# EAGLE design chonkeegamp (EAGLE 9.6.2)
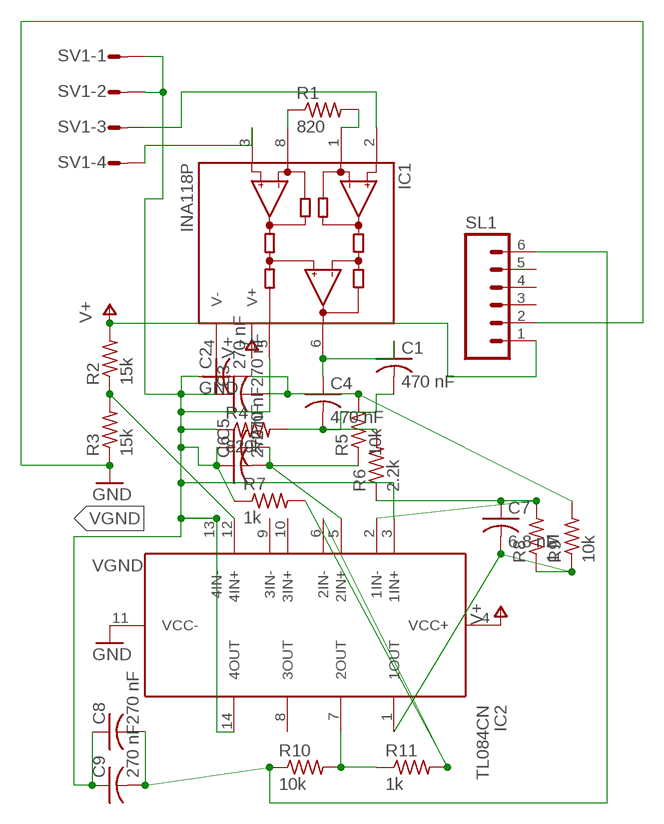
[diagram p0: schematic, sheet 1]

## Parts
C1  470 nF  C-US050-024X044  [C050-024X044]
C2  270 nF  C-US050-024X044  [C050-024X044]
C3  270 nF  C-US050-024X044  [C050-024X044]
C4  470 nF  C-US050-024X044  [C050-024X044]
C5  270 nF  C-US050-024X044  [C050-024X044]
C6  270 nF  C-US050-024X044  [C050-024X044]
C7  6.8 nF  C-US050-024X044  [C050-024X044]
C8  270 nF  C-US050-024X044  [C050-024X044]
C9  270 nF  C-US050-024X044  [C050-024X044]
IC1  INA118P  [DIL08]
IC2  TL084CN  [DIP794W53P254L1930H508Q14N]
R1  820  R-US_0207/7  [0207/7]
R2  15k  R-US_0207/7  [0207/7]
R3  15k  R-US_0207/7  [0207/7]
R4  820k  R-US_0207/7  [0207/7]
R5  10k  R-US_0207/7  [0207/7]
R6  2.2k  R-US_0207/7  [0207/7]
R7  1k  R-US_0207/7  [0207/7]
R8  1 M  R-US_0207/7  [0207/7]
R9  10k  R-US_0207/7  [0207/7]
R10  10k  R-US_0207/7  [0207/7]
R11  1k  R-US_0207/7  [0207/7]
SL1  M06  [06P]
SV1  L04P  [L04P]

## Nets
GND: IC1.4(V-) IC2.11(VCC-) R3.1 SL1.2
N$1: C1.1 C4.1 IC1.6(OUT)
N$2: C1.2 C4.2 R4.2 R6.2
N$3: C7.1 IC2.2(1IN-) R6.1 R8.2
N$4: C7.2 IC2.1(1OUT) R8.1 R9.1
N$5: C2.2 C3.2 R5.2 R9.2
N$6: C5.2 C6.2 IC2.5(2IN+) R5.1
N$7: IC1.3(+IN) SV1.4
N$8: IC2.6(2IN-) R7.2 R11.2
N$9: IC2.7(2OUT) R10.2 R11.1
N$10: C8.2 C9.2 R10.1 SL1.6
N$11: IC2.12(4IN+) R2.1 R3.2
N$12: IC1.2(-IN) SV1.3
N$15: IC1.1(RG) R1.2
N$16: IC1.8(RG) R1.1
V+: IC1.7(V+) IC2.4(VCC+) R2.2 SL1.1
VGND: C2.1 C3.1 C5.1 C6.1 C8.1 C9.1 IC1.5(REF) IC2.3(1IN+) IC2.13(4IN-) IC2.14(4OUT) R4.1 R7.1 SV1.1 SV1.2
Unconnected: IC2.8(3OUT) IC2.9(3IN-) IC2.10(3IN+) SL1.3 SL1.4 SL1.5

## Library data of the parts
C1 C4 = rcl:C-US: CAPACITOR, American symbol; MF: VISHAY; MPN: BFC237390043; OC_NEWARK: 04J0056; SPICEPREFIX: C
C2 C3 C5 C6 C8 C9 = rcl:C-US: CAPACITOR, American symbol; MF: VISHAY; MPN: BFC237390132; OC_NEWARK: 04J0079; SPICEPREFIX: C
C7 = rcl:C-US: CAPACITOR, American symbol; MF: KEMET; MPN: C315C682K1R5TA; OC_NEWARK: 18K5618; SPICEPREFIX: C
IC1 = burr-brown:INA118: Instrumentation Amplifier Precision, Low Power; MF: TEXAS INSTRUMENTS; MPN: INA118P; OC_FARNELL: 1470354; OC_NEWARK: 34AH0811
IC2 = SamacSys_Parts:TL084CN: Quad High Slew Rate JFET-Input Operational Amplifier Source: Datasheet <http://www.ti.com/lit/gpn/tl084>; DESCRIPTION: Quad High Slew Rate JFET-Input Operational Amplifier; HEIGHT: 5.08mm; MANUFACTURER_NAME: Texas Instruments; MANUFACTURER_PART_NUMBER: TL084CN; MF: TEXAS INSTRUMENTS; MOUSER_PART_NUMBER: 595-TL084CN; MOUSER_PRICE-STOCK: https://www.mouser.co.uk/ProductDetail/Texas-Instruments/TL084CN?qs=q2XTDbzbm6ANF36GVAxPiQ%3D%3D; MPN: TL084CN; OC_NEWARK: 33AH5107
R1 = rcl:R-US_: RESISTOR, American symbol; MF: MULTICOMP PRO; MPN: MCF 0.5W 820R; OC_NEWARK: 38K0319; SPICEPREFIX: R
R2 R3 = rcl:R-US_: RESISTOR, American symbol; MF: MULTICOMP PRO; MPN: MCF 1W 15K; OC_NEWARK: 38K0408; SPICEPREFIX: R
R4 = rcl:R-US_: RESISTOR, American symbol; MF: MULTICOMP PRO; MPN: MCF 0.25W 820K; OC_NEWARK: 38K0396; SPICEPREFIX: R
R5 R9 R10 = rcl:R-US_: RESISTOR, American symbol; MF: MULTICOMP PRO; MPN: MCCFR0W4J0103A50; OC_NEWARK: 58K5002; SPICEPREFIX: R
R6 = rcl:R-US_: RESISTOR, American symbol; MF: MULTICOMP PRO; MPN: MCF 0.5W 2K2; OC_NEWARK: 38K0282; SPICEPREFIX: R
R7 R11 = rcl:R-US_: RESISTOR, American symbol; MF: MULTICOMP PRO; MPN: MCCFR0S2J0102A20; OC_NEWARK: 58K4936; SPICEPREFIX: R
R8 = rcl:R-US_: RESISTOR, American symbol; MF: MULTICOMP PRO; MPN: MCF 0.5W 1M; OC_NEWARK: 38K0261; SPICEPREFIX: R
SL1 = con-amp-quick:M06: AMP QUICK CONNECTOR; OC_FARNELL: unknown; OC_NEWARK: unknown
SV1 = con-amp-mt:L04P: AMP MT CONNECTOR; OC_FARNELL: unknown; OC_NEWARK: unknown

## Board
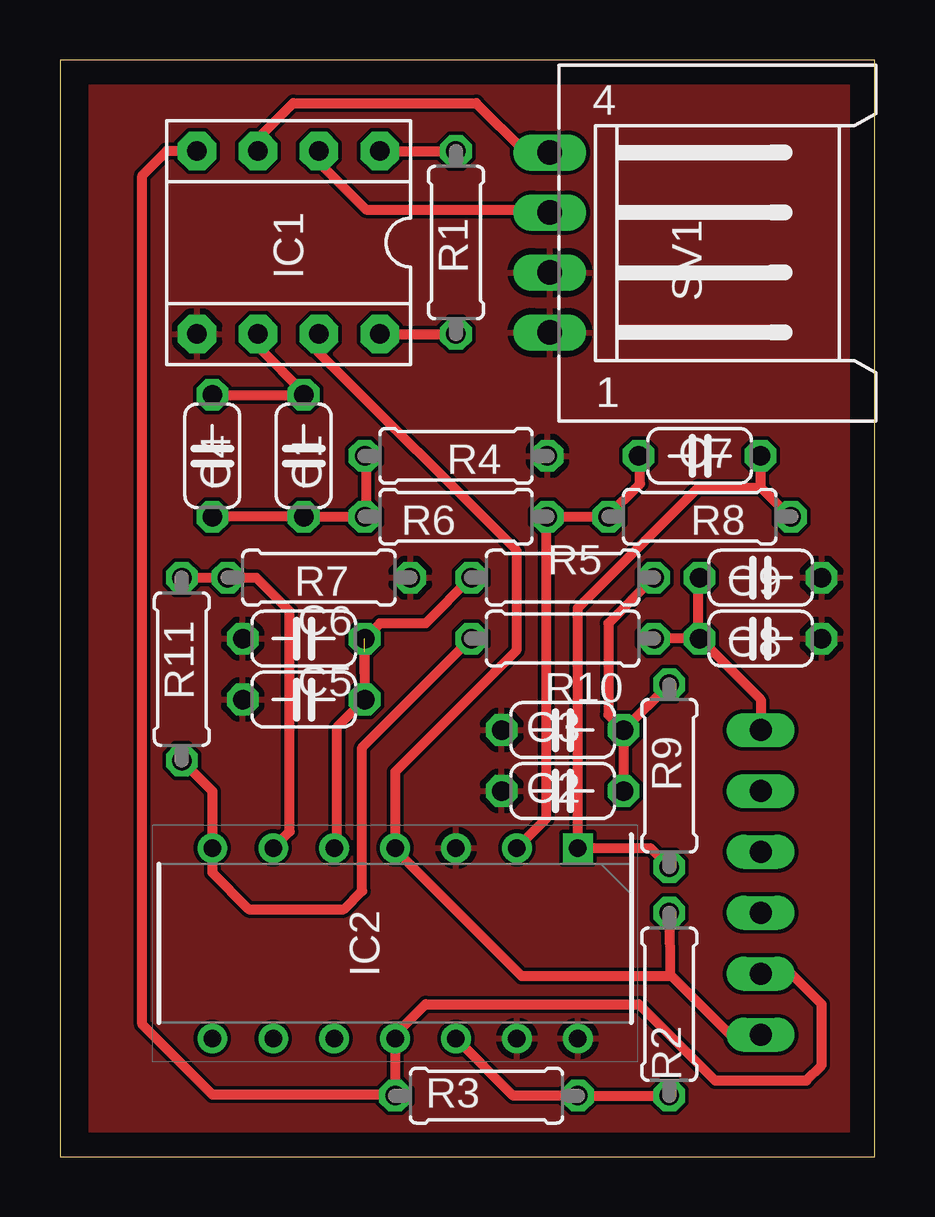
[diagram p1: board, top side]
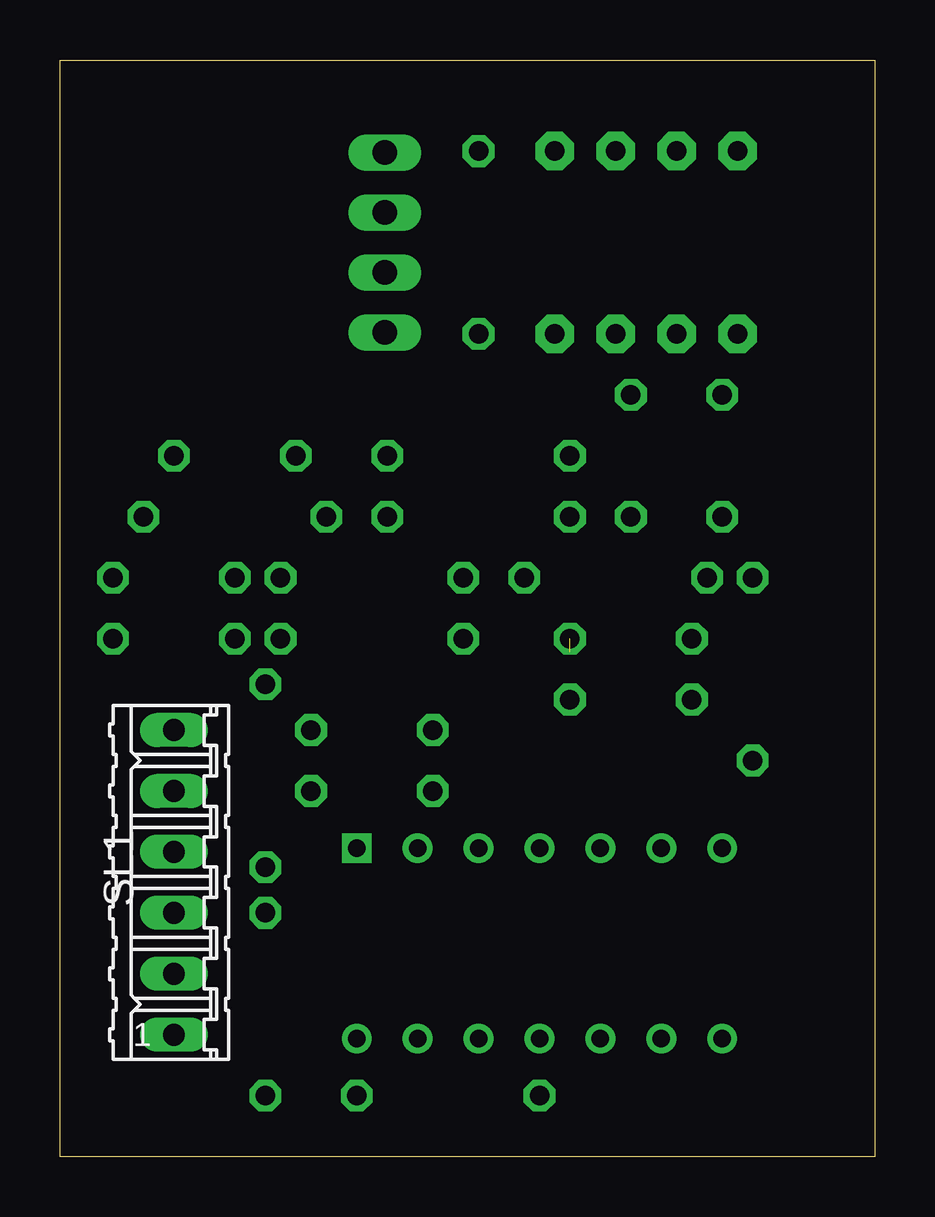
[diagram p2: board, bottom side, seen from below]

Size 33.96 x 45.71 mm. Coordinates in mm from the lower left corner, seen from the top.
Outline: 0,0 33.96,0 33.96,45.71 0,45.71 0,0
Copper layers (1*16): Top 0.035mm / dielectric 1.5mm / Bottom 0.035mm
Design rules "default": minimum track width 6mil, minimum drill 0.35mm, track to track 6mil, track to pad 6mil, pad to pad 6mil, via to via 6mil, smd to smd 6mil, copper to edge 40mil, drill to drill 6mil, minimum pad ring 10mil, minimum via ring 8mil, stop-mask expansion 4mil, vias tented up to drill 0mil, thermal gap 10mil

### Footprints (pad centres in the part's own frame; a part is rotated, then mirrored left to right if it is on the bottom)
C050-024X044 = drill 0.813 octagon: 1 -2.54,0; 2 2.54,0
DIL08 = drill 0.813 pad 1.6 octagon: 1 -3.81,-3.81; 2 -1.27,-3.81; 3 1.27,-3.81; 4 3.81,-3.81; 5 3.81,3.81; 6 1.27,3.81; 7 -1.27,3.81; 8 -3.81,3.81
DIP794W53P254L1930H508Q14N = drill 0.73 pad 1.13 square: 1 -3.97,7.62 | drill 0.73 pad 1.13: 2 -3.97,5.08; 3 -3.97,2.54; 4 -3.97,0; 5 -3.97,-2.54; 6 -3.97,-5.08; 7 -3.97,-7.62; 8 3.97,-7.62; 9 3.97,-5.08; 10 3.97,-2.54; 11 3.97,0; 12 3.97,2.54; 13 3.97,5.08; 14 3.97,7.62
0207/7 = drill 0.813 octagon: 1 -3.81,0; 2 3.81,0
06P = drill 0.914 long: 1 -6.35,0; 2 -3.81,0; 3 -1.27,0; 4 1.27,0; 5 3.81,0; 6 6.35,0
L04P = drill 1.016 long: 1 3.75,-6.25; 2 1.25,-6.25; 3 -1.25,-6.25; 4 -3.75,-6.25

### Placement (x,y rotation side)
C1  10.16,29.21 270 top
C2  20.95,15.24 0 top
C3  20.95,17.78 0 top
C4  6.35,29.21 270 top
C5  10.16,19.05 0 top
C6  10.16,21.59 0 top
C7  26.67,29.21 0 top
C8  29.21,21.59 180 top
C9  29.21,24.13 180 top
IC1  9.53,38.1 180 top
IC2  13.97,8.89 270 top
R1  16.51,38.1 90 top
R2  25.4,6.35 90 top
R3  17.78,2.54 0 top
R4  16.51,29.21 180 top
R5  20.95,24.13 0 top
R6  16.51,26.67 180 top
R7  10.8,24.13 180 top
R8  26.67,26.67 180 top
R9  25.4,15.88 90 top
R10  20.95,21.59 180 top
R11  5.08,20.32 90 top
SL1  29.21,11.43 90 bottom
SV1  26.67,38.1 270 top

### Tracks (layer width: path | path; a pad name or v marks a point on that pad's centre or on a via)
GND
  Top 0.152: 13.97,4.88 IC2.11 14.08,5.03 | 13.97,2.59 R3.1
  Top 0.254: IC2.11 13.97,5.08
  Top 0.406: 13.97,2.59 6.35,2.59 3.43,5.51 3.43,40.89 4.45,41.91 IC1.4 | IC2.11 R3.1 | 13.97,5.08 15.24,6.35 24.13,6.35 27.3,3.18 31.11,3.18 31.75,3.81 31.75,6.35 30.48,7.62 SL1.2
N$1
  Top 0.152: 10.16,31.85 C1.1
  Top 0.406: 10.16,31.85 8.25,33.76 IC1.6 | C4.1 C1.1
N$2
  Top 0.152: 12.75,26.67 R6.2
  Top 0.305: 12.75,29.11 R4.2
  Top 0.406: 12.75,29.11 12.75,26.67 | C4.2 C1.2 R6.2
N$3
  Top 0.152: 20.27,26.57 20.37,26.67 R6.1 | 24.18,29.11 C7.1 | 22.81,26.67 R8.2
  Top 0.406: 20.27,26.57 20.27,14.08 IC2.2 | 20.37,26.67 22.81,26.67 24.18,28.04 24.18,29.11
N$4
  Top 0.152: 30.43,26.67 R8.1
  Top 0.406: 29.21,27.89 C7.2 | 30.43,26.67 29.21,27.89 | R9.1 24.61,12.86 IC2.1 21.59,22.86 26.62,27.89 29.21,27.89
N$5
  Top 0.406: C3.2 C2.2 | C3.2 22.86,18.41 22.86,22.23 R5.2 | R9.2 C3.2
N$6  (1 unrouted)
  Top 0.406: IC2.5 11.53,12.95 11.53,17.88 C5.2 12.7,21.03 | 12.7,20.12 C6.2 13.34,22.23 15.24,22.23 R5.1
N$7
  Top 0.406: SV1.4 20.27,41.91 19.36,41.91 17.35,43.92 9.73,43.92 8.25,42.44 IC1.3
N$8
  Top 0.152: 5.13,24.08 R11.2
  Top 0.406: R11.2 R7.2 8.18,24.13 9.58,22.73 9.58,13.55 IC2.6
N$9
  Top 0.406: R11.1 6.35,15.24 IC2.7 6.35,11.84 7.87,10.31 11.84,10.31 12.6,11.07 12.6,17.04 R10.2
N$10
  Top 0.152: 26.62,24.13 C9.2 | 26.62,21.69 C8.2
  Top 0.406: R10.1 C8.2 29.21,19.05 SL1.6 | 26.62,21.69 26.62,24.13
N$11
  Top 0.152: IC2.12 16.56,4.87 | 21.59,2.59 R3.2 | 24.83,2.59 R2.1
  Top 0.406: R2.1 R3.2 18.89,2.54 IC2.12
N$12
  Top 0.406: IC1.2 10.8,41.43 12.75,39.47 20.27,39.47 SV1.3
N$15
  Top 0.406: IC1.1 R1.2
N$16
  Top 0.406: IC1.8 R1.1
V+
  Top 0.152: 13.97,12.8 IC2.4 | 25.43,10.13 R2.2 | 10.77,34.27 IC1.7
  Top 0.305: 25.5,7.52 25.45,7.52
  Top 0.406: 13.97,12.8 19.25,7.52 25.45,7.52 25.43,10.13 | SL1.1 27.94,5.08 25.5,7.52 | 10.77,34.27 10.77,33.53 19.02,25.27 19.02,21.09 13.97,16.04 IC2.4
VGND
  pour Top: 1.27,46.99 1.27,-15.24 54.61,-15.24 54.61,46.99